# Altium schematic sheet GarageBeamSafety.SchDoc
size A4
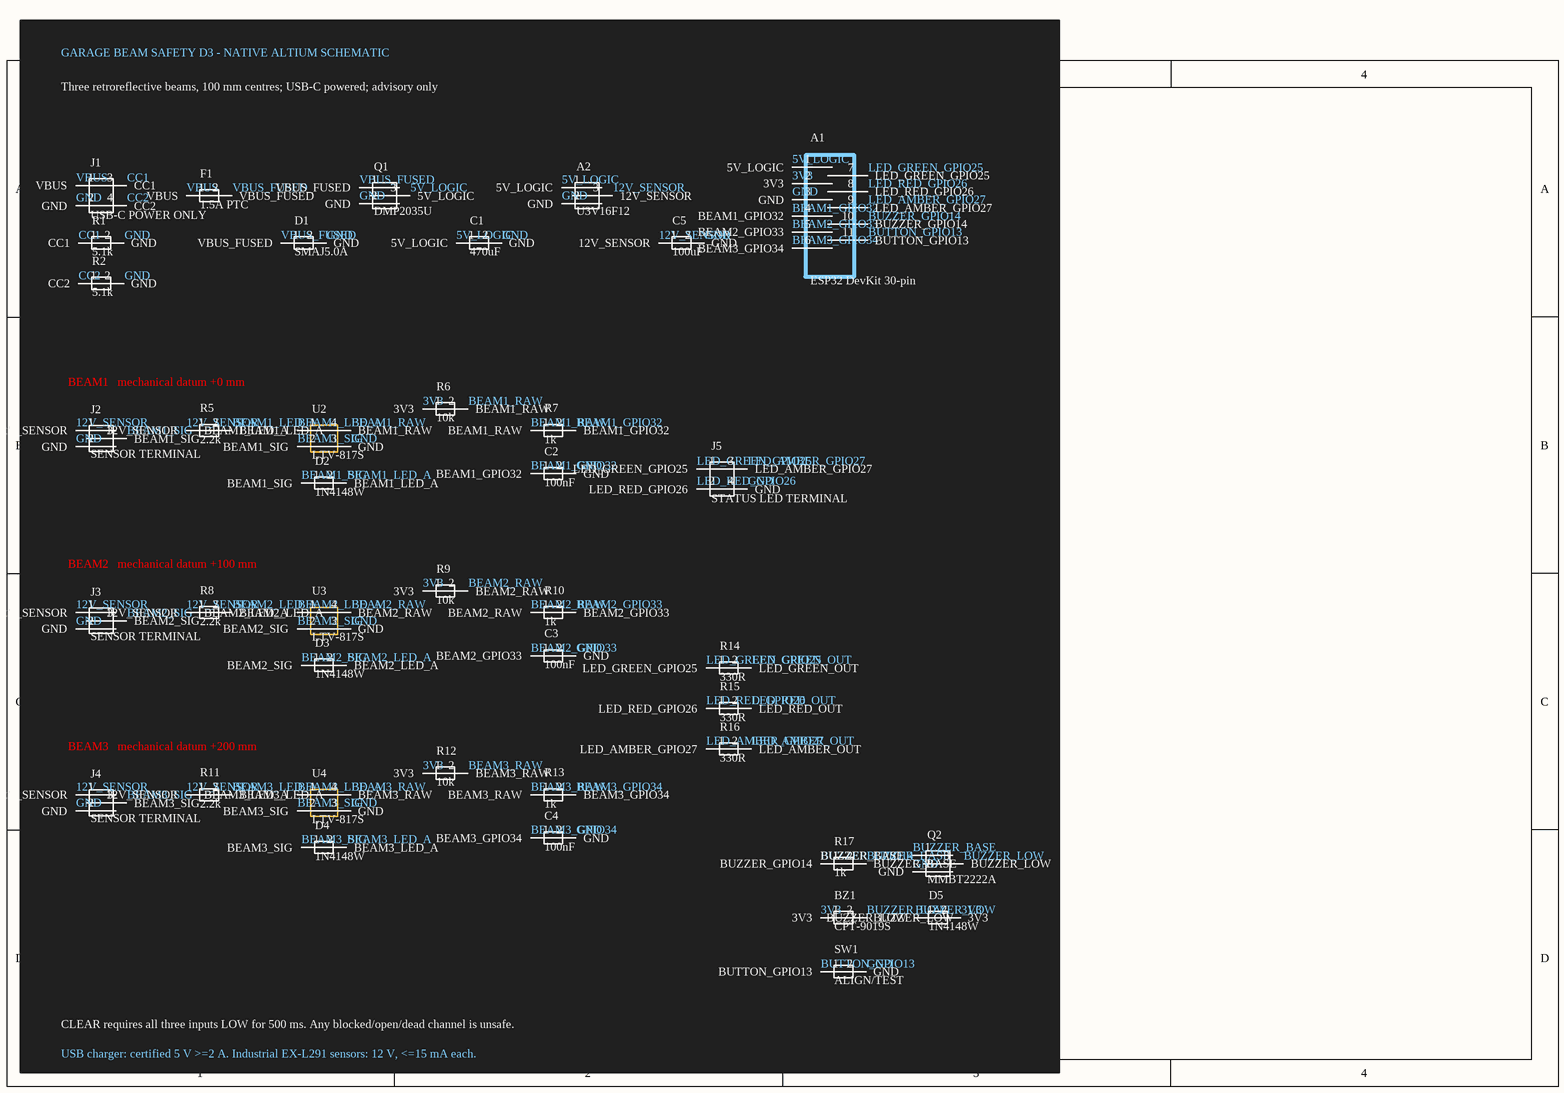
[diagram p0: GarageBeamSafety.SchDoc]

## Parts
A1  ESP32 DevKit 30-pin  [ESP32_DEVKIT_30PIN_SOCKET]
A2  U3V16F12  [POLOLU_U3V16F12]
BZ1  CPT-9019S  [BUZZER_9X9]
C1  470uF  [CAP_SMD_10X10]
C2  100nF  [C0805]
C3  100nF  [C0805]
C4  100nF  [C0805]
C5  100uF  [CAP_SMD_8X10]
D1  SMAJ5.0A  [SMA]
D2  1N4148W  [SOD123]
D3  1N4148W  [SOD123]
D4  1N4148W  [SOD123]
D5  1N4148W  [SOD123]
F1  1.5A PTC  [F1812]
J1  USB-C POWER ONLY  [USB4125_6PIN]
J2  SENSOR TERMINAL  [TERM_3_508]
J3  SENSOR TERMINAL  [TERM_3_508]
J4  SENSOR TERMINAL  [TERM_3_508]
J5  STATUS LED TERMINAL  [TERM_4_508]
Q1  DMP2035U  [SOT23]
Q2  MMBT2222A  [SOT23]
R1  5.1k  [R0805]
R2  5.1k  [R0805]
R5  2.2k  [R0805]
R6  10k  [R0805]
R7  1k  [R0805]
R8  2.2k  [R0805]
R9  10k  [R0805]
R10  1k  [R0805]
R11  2.2k  [R0805]
R12  10k  [R0805]
R13  1k  [R0805]
R14  330R  [R0805]
R15  330R  [R0805]
R16  330R  [R0805]
R17  1k  [R0805]
SW1  ALIGN/TEST  [SW_SMD_6X6]
U2  LTV-817S  [LTV817S_SMD4]
U3  LTV-817S  [LTV817S_SMD4]
U4  LTV-817S  [LTV817S_SMD4]

## Nets

Not connected (* = marked no-connect by the designer): A1 1(5V_LOGIC) 2(3V3) 3(GND) 4(BEAM1_GPIO32) 5(BEAM2_GPIO33) 6(BEAM3_GPIO34) 7(LED_GREEN_GPIO25) 8(LED_RED_GPIO26) 9(LED_AMBER_GPIO27) 10(BUZZER_GPIO14) 11(BUTTON_GPIO13); A2 1(5V_LOGIC) 2(GND) 3(12V_SENSOR); BZ1 1(3V3) 2(BUZZER_LOW); C1 1(5V_LOGIC) 2(GND); C2 1(BEAM1_GPIO32) 2(GND); C3 1(BEAM2_GPIO33) 2(GND); C4 1(BEAM3_GPIO34) 2(GND); C5 1(12V_SENSOR) 2(GND); D1 1(VBUS_FUSED) 2(GND); D2 1(BEAM1_SIG) 2(BEAM1_LED_A); D3 1(BEAM2_SIG) 2(BEAM2_LED_A); D4 1(BEAM3_SIG) 2(BEAM3_LED_A); D5 1(BUZZER_LOW) 2(3V3); F1 1(VBUS) 2(VBUS_FUSED); J1 1(VBUS) 2(GND) 3(CC1) 4(CC2); J2 1(12V_SENSOR) 2(GND) 3(BEAM1_SIG); J3 1(12V_SENSOR) 2(GND) 3(BEAM2_SIG); J4 1(12V_SENSOR) 2(GND) 3(BEAM3_SIG); J5 1(LED_GREEN_GPIO25) 2(LED_RED_GPIO26) 3(LED_AMBER_GPIO27) 4(GND); Q1 1(VBUS_FUSED) 2(GND) 3(5V_LOGIC); Q2 1(BUZZER_BASE) 2(GND) 3(BUZZER_LOW); R1 1(CC1) 2(GND); R2 1(CC2) 2(GND); R5 1(12V_SENSOR) 2(BEAM1_LED_A); R6 1(3V3) 2(BEAM1_RAW); R7 1(BEAM1_RAW) 2(BEAM1_GPIO32); R8 1(12V_SENSOR) 2(BEAM2_LED_A); R9 1(3V3) 2(BEAM2_RAW); R10 1(BEAM2_RAW) 2(BEAM2_GPIO33); R11 1(12V_SENSOR) 2(BEAM3_LED_A); R12 1(3V3) 2(BEAM3_RAW); R13 1(BEAM3_RAW) 2(BEAM3_GPIO34); R14 1(LED_GREEN_GPIO25) 2(LED_GREEN_OUT); R15 1(LED_RED_GPIO26) 2(LED_RED_OUT); R16 1(LED_AMBER_GPIO27) 2(LED_AMBER_OUT); R17 1(BUZZER_GPIO14) 2(BUZZER_BASE); SW1 1(BUTTON_GPIO13) 2(GND); U2 1(BEAM1_LED_A) 2(BEAM1_SIG) 3(GND) 4(BEAM1_RAW); U3 1(BEAM2_LED_A) 2(BEAM2_SIG) 3(GND) 4(BEAM2_RAW); U4 1(BEAM3_LED_A) 2(BEAM3_SIG) 3(GND) 4(BEAM3_RAW)

## Notes on the sheet
- GARAGE BEAM SAFETY D3 - NATIVE ALTIUM SCHEMATIC
- Three retroreflective beams, 100 mm centres; USB-C powered; advisory only
- (near A1) 5V_LOGIC
- (near A1) LED_GREEN_GPIO25
- (near J1) VBUS
- (near J1) GND
- (near J1) CC1
- (near J1) CC2
- (near F1) VBUS
- (near F1) VBUS_FUSED
- (near Q1) VBUS_FUSED
- (near Q1) GND
- (near Q1) 5V_LOGIC
- (near A2) 5V_LOGIC
- (near A2) GND
- (near A2) 12V_SENSOR
- (near A1) 3V3
- (near A1) GND
- (near A1) BEAM1_GPIO32
- (near A1) BEAM2_GPIO33
- (near A1) LED_RED_GPIO26
- (near A1) LED_AMBER_GPIO27
- (near A1) BUZZER_GPIO14
- (near A1) BUTTON_GPIO13
- (near R1) CC1
- (near R2) CC2
- (near R1) GND
- (near R2) GND
- (near D1) VBUS_FUSED
- (near D1) GND
- (near C1) 5V_LOGIC
- (near C1) GND
- (near C5) 12V_SENSOR
- (near C5) GND
- (near A1) BEAM3_GPIO34
- BEAM1   mechanical datum +0 mm
- (near J2) 12V_SENSOR
- (near J2) BEAM1_SIG
- (near R5) 12V_SENSOR
- BEAM1_LED_A
- (near U2) BEAM1_LED_A
- (near U2) BEAM1_RAW
- (near R6) 3V3
- (near R6) BEAM1_RAW
- (near R7) BEAM1_RAW
- (near R7) BEAM1_GPIO32
- (near J2) GND
- (near U2) BEAM1_SIG
- (near D2) BEAM1_SIG
- (near D2) BEAM1_LED_A
- (near U2) GND
- (near C2) BEAM1_GPIO32
- (near C2) GND
- (near J5) LED_GREEN_GPIO25
- (near J5) LED_RED_GPIO26
- (near J5) LED_AMBER_GPIO27
- (near J5) GND
- BEAM2   mechanical datum +100 mm
- (near J3) 12V_SENSOR
- (near J3) GND
- (near J3) BEAM2_SIG
- (near R8) 12V_SENSOR
- BEAM2_LED_A
- (near U3) BEAM2_LED_A
- (near U3) BEAM2_SIG
- (near U3) GND
- (near U3) BEAM2_RAW
- (near R9) 3V3
- (near R9) BEAM2_RAW
- (near R10) BEAM2_RAW
- (near R10) BEAM2_GPIO33
- (near D3) BEAM2_SIG
- (near D3) BEAM2_LED_A
- (near C3) BEAM2_GPIO33
- (near C3) GND
- (near R14) LED_GREEN_GPIO25
- (near R15) LED_RED_GPIO26
- (near R14) LED_GREEN_OUT
- (near R15) LED_RED_OUT
- BEAM3   mechanical datum +200 mm
- (near R12) 3V3
- (near R12) BEAM3_RAW
- (near R16) LED_AMBER_GPIO27
- (near R16) LED_AMBER_OUT
- (near J4) 12V_SENSOR
- (near J4) GND
- (near J4) BEAM3_SIG
- (near R11) 12V_SENSOR
- BEAM3_LED_A
- (near U4) BEAM3_LED_A
- (near U4) BEAM3_SIG
- (near D4) BEAM3_SIG
- (near D4) BEAM3_LED_A
- (near U4) GND
- (near U4) BEAM3_RAW
- (near R13) BEAM3_RAW
- (near C4) BEAM3_GPIO34
- (near R13) BEAM3_GPIO34
- (near C4) GND
- (near R17) BUZZER_GPIO14
- BUZZER_BASE
- (near Q2) BUZZER_BASE
- (near Q2) GND
- (near Q2) BUZZER_LOW
- (near BZ1) 3V3
- (near SW1) BUTTON_GPIO13
- BUZZER_LOW
- (near SW1) GND
- (near D5) BUZZER_LOW
- (near D5) 3V3
- CLEAR requires all three inputs LOW for 500 ms. Any blocked/open/dead channel is unsafe.
- USB charger: certified 5 V >=2 A. Industrial EX-L291 sensors: 12 V, <=15 mA each.

## Library data of the parts
A1 = *: Socketed ESP32-WROOM development board; Manufacturer: Espressif-compatible; Manufacturer Part Number: ESP32-DevKitC / verified 30-pin; Populate: User supplied; Package: ESP32_DEVKIT_30PIN_SOCKET
A2 = *: Regulated 5V-to-12V boost module; Manufacturer: Pololu; Manufacturer Part Number: 4945; Populate: Yes; Package: POLOLU_U3V16F12
BZ1 = *: 3V magnetic transducer; Manufacturer: CUI Devices; Manufacturer Part Number: CPT-9019S-SMT-TR; Populate: Yes; Package: BUZZER_9X9
C1 = *: 5V bulk capacitor; Manufacturer: Panasonic; Manufacturer Part Number: EEE-FK1A471P; Populate: Yes; Package: CAP_SMD_10X10
C2-C4 = *: GPIO input filter; Manufacturer: Murata; Manufacturer Part Number: GRM21BR71H104KA01L; Populate: Yes; Package: C0805
C5 = *: 12V sensor rail bulk capacitor; Manufacturer: Panasonic; Manufacturer Part Number: EEE-FK1E101P; Populate: Yes; Package: CAP_SMD_8X10
D1 = *: 5V VBUS TVS diode; Manufacturer: Littelfuse; Populate: Yes; Manufacturer Part Number: SMAJ5.0A; Package: SMA
D2-D4 = *: Reverse clamp across optocoupler input; Manufacturer: Nexperia; Populate: Yes; Manufacturer Part Number: 1N4148W; Package: SOD123
D5 = *: Buzzer flyback clamp; Manufacturer: Nexperia; Populate: Yes; Manufacturer Part Number: 1N4148W; Package: SOD123
F1 = *: Resettable input fuse; Manufacturer: Bourns; Manufacturer Part Number: MF-MSMF150-2; Populate: Yes; Package: F1812
J1 = *: 6-pin charge-only USB-C receptacle, 3A; Manufacturer: GCT; Manufacturer Part Number: USB4125-GF-A-0190; Populate: Yes; Package: USB4125_6PIN
J2-J4 = *: 5.08mm terminal 12V/0V/SIG; Manufacturer: Phoenix Contact; Manufacturer Part Number: 1729131; Populate: Yes; Package: TERM_3_508
J5 = *: External status LED connector; Manufacturer: Phoenix Contact; Manufacturer Part Number: 1729144; Populate: Yes; Package: TERM_4_508
Q1 = *: P-channel reverse-current protection MOSFET; Manufacturer: Diodes Inc; Populate: Yes; Manufacturer Part Number: DMP2035U; Package: SOT23
Q2 = *: Buzzer low-side driver; Manufacturer: Diodes Inc; Populate: Yes; Manufacturer Part Number: MMBT2222A; Package: SOT23
R1 = *: USB-C CC1 pull-down; Manufacturer: Yageo; Manufacturer Part Number: RC0805FR-075K1L; Populate: Yes; Package: R0805
R2 = *: USB-C CC2 pull-down; Manufacturer: Yageo; Manufacturer Part Number: RC0805FR-075K1L; Populate: Yes; Package: R0805
R5 R8 R11 = *: Optocoupler input resistor; Manufacturer: Yageo; Manufacturer Part Number: RC0805FR-072K2L; Populate: Yes; Package: R0805
R6 R9 R12 = *: GPIO pull-up; Manufacturer: Yageo; Manufacturer Part Number: RC0805FR-0710KL; Populate: Yes; Package: R0805
R7 R10 R13 = *: GPIO series resistor; Manufacturer: Yageo; Manufacturer Part Number: RC0805FR-071KL; Populate: Yes; Package: R0805
R14 = *: Green LED current limit; Manufacturer: Yageo; Manufacturer Part Number: RC0805FR-07330RL; Populate: Yes; Package: R0805
R15 = *: Red LED current limit; Manufacturer: Yageo; Manufacturer Part Number: RC0805FR-07330RL; Populate: Yes; Package: R0805
R16 = *: Amber LED current limit; Manufacturer: Yageo; Manufacturer Part Number: RC0805FR-07330RL; Populate: Yes; Package: R0805
R17 = *: Buzzer transistor base resistor; Manufacturer: Yageo; Manufacturer Part Number: RC0805FR-071KL; Populate: Yes; Package: R0805
SW1 = *: Alignment and test tactile switch; Manufacturer: Omron; Manufacturer Part Number: B3FS-1000P; Populate: Yes; Package: SW_SMD_6X6
U2-U4 = *: Phototransistor optocoupler; Manufacturer: Lite-On; Manufacturer Part Number: LTV-817S-TA1; Description: Phototransistor optocoupler SMD-4; Populate: Yes; Package: LTV817S_SMD4